# Altium schematic sheet MODEM_PT1.SchDoc: MODEM PERIPHERALS
size 420 x 297 mm; SheetNumber: 7; SheetTotal: 8
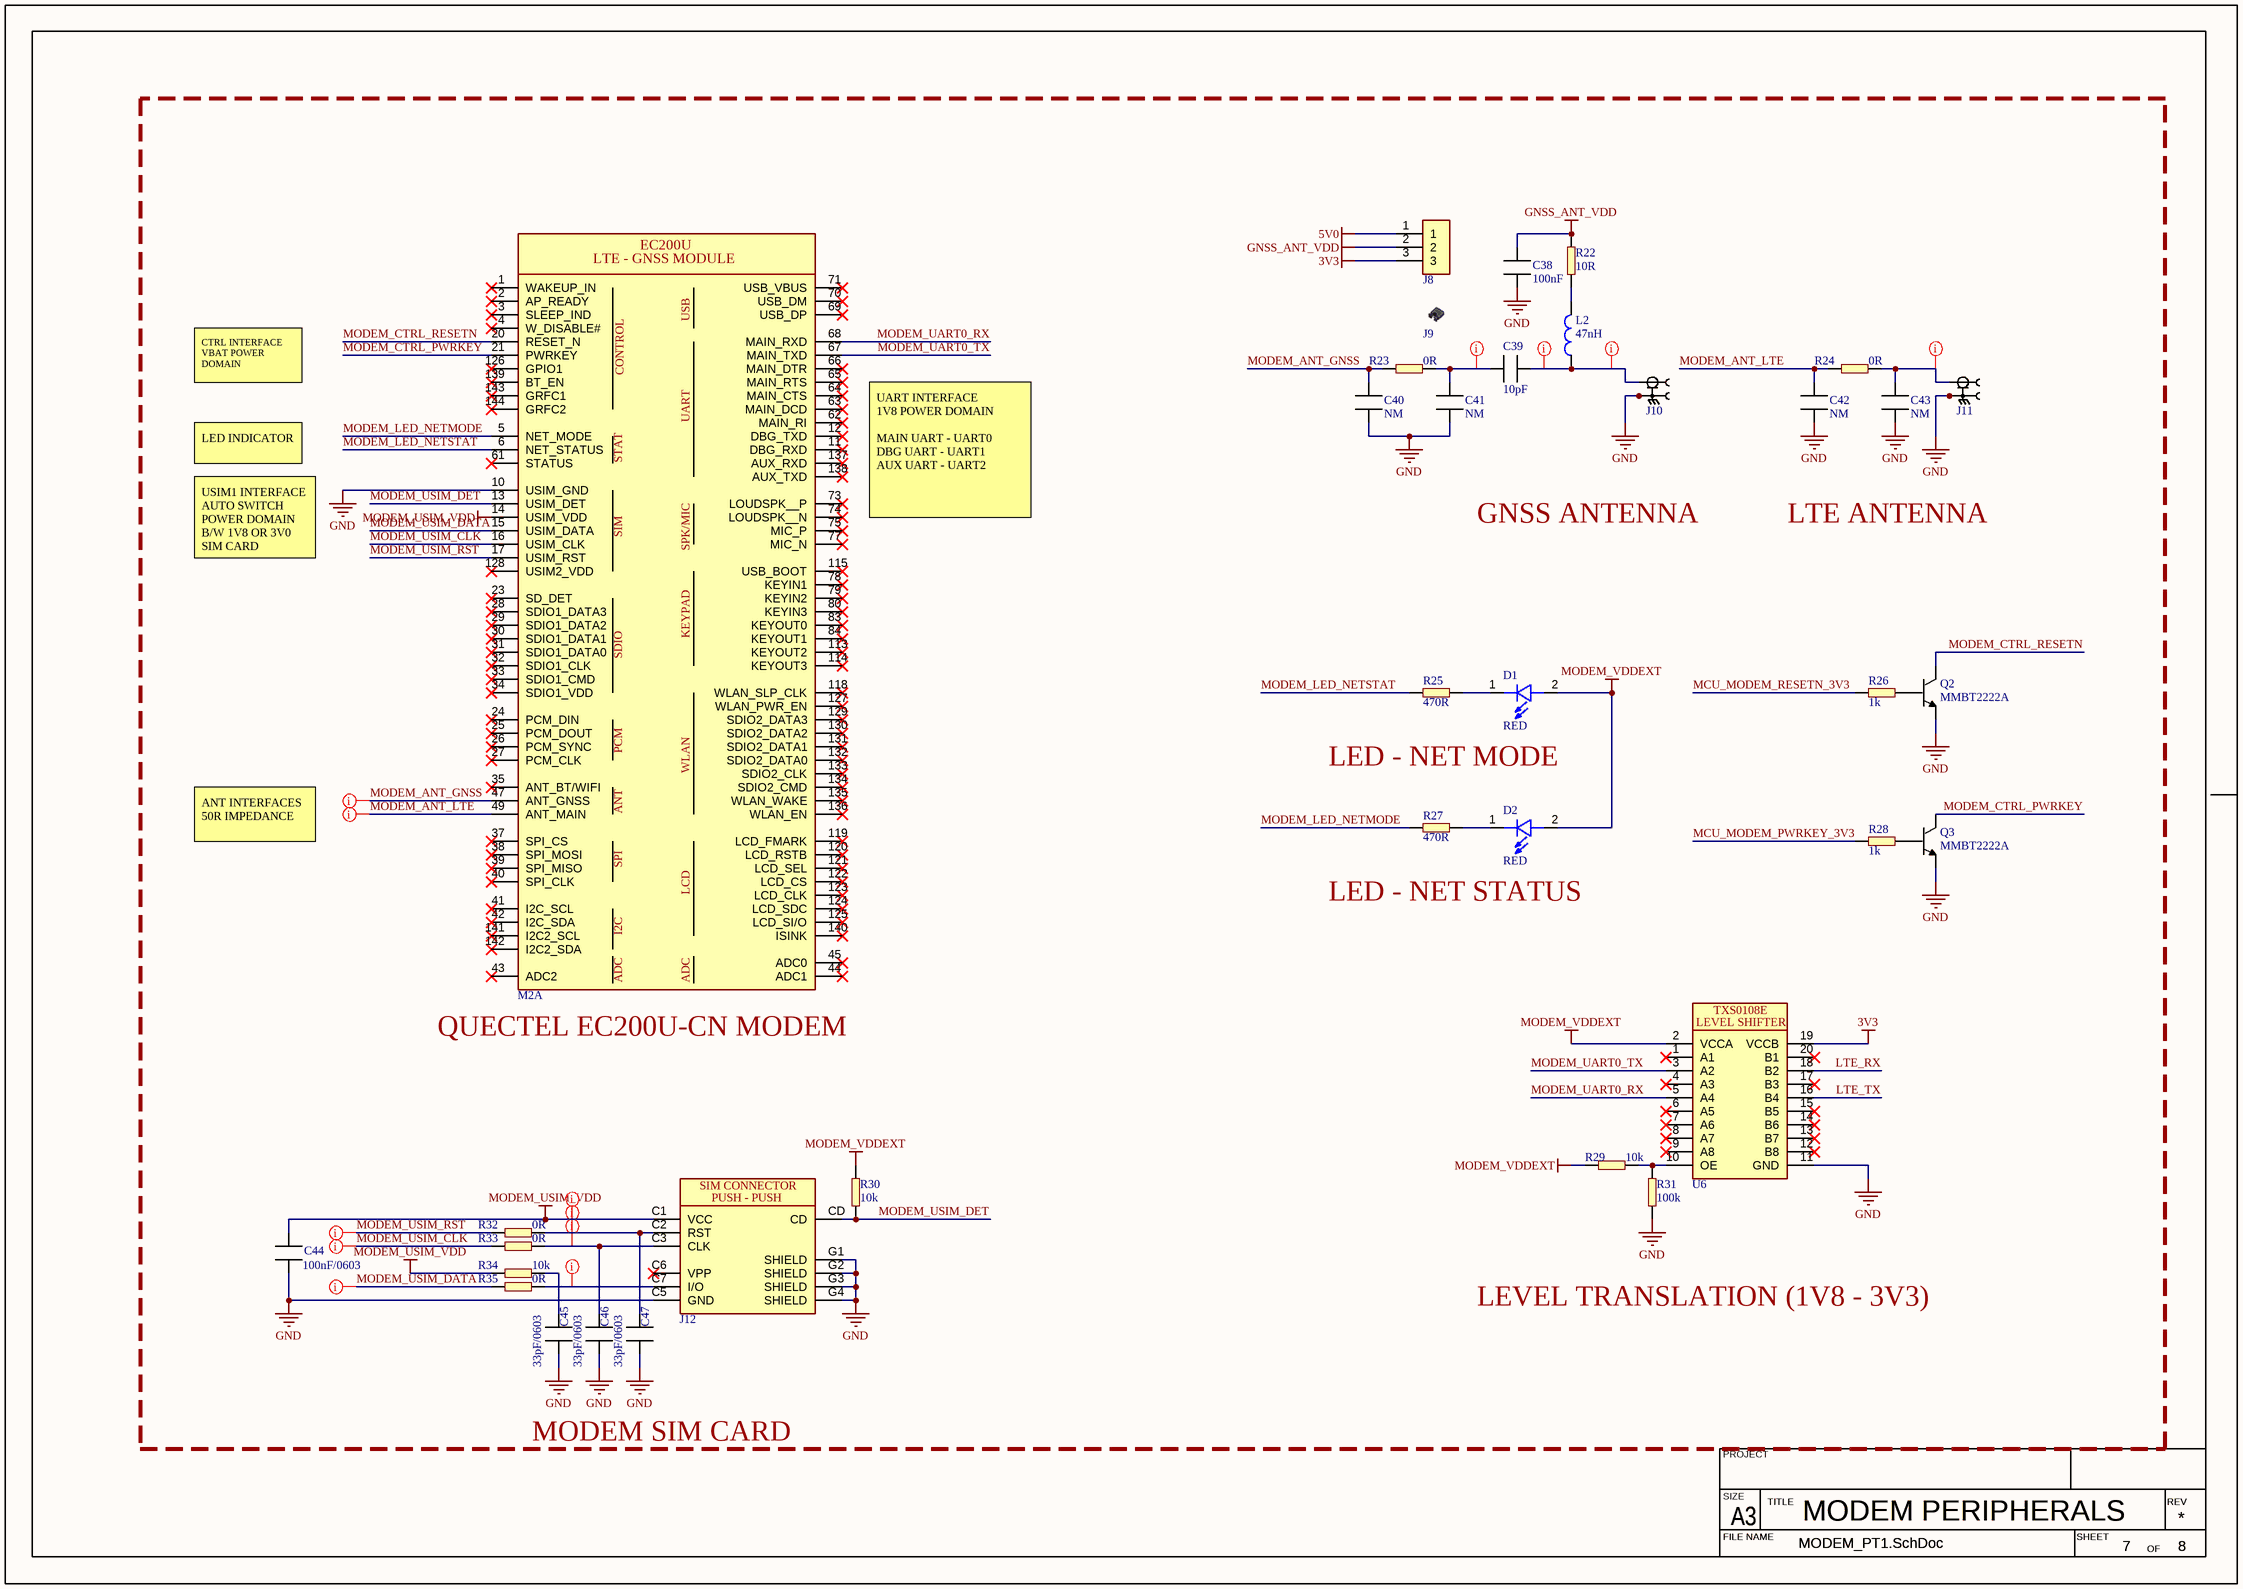
[diagram p0: MODEM_PT1.SchDoc]

## Parts
C38  value 100nF  [CAPC2012X13L]  (hidden comment: MLCC_0805)  (no BOM)
C39  value 10pF  [CAPC0603X03L]  (hidden comment: ERP_102-1)
C40  value NM  [CAPC0603X03L]  (hidden comment: ERP_102-1)  (no BOM)
C41  value NM  [CAPC0603X03L]  (hidden comment: ERP_102-1)  (no BOM)
C42  value NM  [CAPC0603X03L]  (hidden comment: ERP_102-1)  (no BOM)
C43  value NM  [CAPC0603X03L]  (hidden comment: ERP_102-1)  (no BOM)
C44  value 100nF/0603  [CAPC1608X10N]  (hidden comment: ERP_102-1)
C45  value 33pF/0603  [CAPC1608X10N]  (hidden comment: ERP_102-1)
C46  value 33pF/0603  [CAPC1608X10N]  (hidden comment: ERP_102-1)
C47  value 33pF/0603  [CAPC1608X10N]  (hidden comment: ERP_102-1)
D1  value RED  [LED_1206]  (hidden comment: LED_1206)
D2  value RED  [LED_1206]  (hidden comment: LED_1206)
J8  3PX1R_M  [3PX1R_THT]  (value not drawn)
J9  Jumper Cap  [Jumper Cap]  (value not drawn)
J10  ERP_148-1  [uFL_50R]  (value not drawn)
J11  ERP_148-1  [uFL_50R]  (value not drawn)
J12  MUP-7801-1  [MUP-7801-1]  (value not drawn)
L2  value 47nH  [IND_0603]  (hidden comment: ERP_103-3)
M2  EC200U  [EC200U]  (value not drawn)  (part A of 2)
Q2  value MMBT2222A  [MMBT2222]  (hidden comment: ERP_105-1)
Q3  value MMBT2222A  [MMBT2222]  (hidden comment: ERP_105-1)
R22  value 10R  [RES_0603]  (hidden comment: ERP_101-1)
R23  value 0R  [RESC0603X03L]  (hidden comment: ERP_101-1)
R24  value 0R  [RESC0603X03L]  (hidden comment: ERP_101-1)
R25  value 470R  [RES_0603]  (hidden comment: ERP_101-1)
R26  value 1k  [RES_0603]  (hidden comment: ERP_101-1)
R27  value 470R  [RES_0603]  (hidden comment: ERP_101-1)
R28  value 1k  [RES_0603]  (hidden comment: ERP_101-1)
R29  value 10k  [RES_0603]  (hidden comment: ERP_101-1)
R30  value 10k  [RES_0603]  (hidden comment: ERP_101-1)
R31  value 100k  [RES_0603]  (hidden comment: ERP_101-1)
R32  value 0R  [RES_0603]  (hidden comment: ERP_101-1)
R33  value 0R  [RES_0603]  (hidden comment: ERP_101-1)
R34  value 10k  [RES_0603]  (hidden comment: ERP_101-1)
R35  value 0R  [RES_0603]  (hidden comment: ERP_101-1)
U6  TXS0108EPW  [TXS0108EPW]  (value not drawn)

## Nets
3V3: J8.3 U6.19(VCCB)
5V0: J8.1
GND: C38.2 C40.1 C41.1 C42.1 C43.1 C44.2 C45.2 C46.2 C47.2 J10.1 J10.2 J11.1 J11.2 J12.C5(GND) J12.G1(SHIELD) J12.G2(SHIELD) J12.G3(SHIELD) J12.G4(SHIELD) M2.10(USIM_GND) Q2.2 Q3.2 R31.2 U6.11(GND)
GNSS_ANT_VDD: C38.1 J8.2 R22.2
MODEM_USIM_VDD: C44.1 J12.C1(VCC) M2.14(USIM_VDD) R34.2
MODEM_VDDEXT: D1.2 D2.2 R29.2 R30.2 U6.2(VCCA)
LTE_RX: U6.18(B2)
LTE_TX: U6.16(B4)
MCU_MODEM_PWRKEY_3V3: R28.2
MCU_MODEM_RESETN_3V3: R26.2
MODEM_ANT_GNSS: C40.2 M2.47(ANT_GNSS) R23.2
MODEM_ANT_LTE: C42.2 M2.49(ANT_MAIN) R24.2
MODEM_CTRL_PWRKEY: M2.21(PWRKEY) Q3.3
MODEM_CTRL_RESETN: M2.20(RESET_N) Q2.3
MODEM_LED_NETMODE: M2.5(NET_MODE) R27.2
MODEM_LED_NETSTAT: M2.6(NET_STATUS) R25.2
MODEM_UART0_RX: M2.68(MAIN_RXD) U6.5(A4)
MODEM_UART0_TX: M2.67(MAIN_TXD) U6.3(A2)
MODEM_USIM_CLK: M2.16(USIM_CLK) R33.2
MODEM_USIM_DATA: M2.15(USIM_DATA) R35.2
MODEM_USIM_DET: J12.CD M2.13(USIM_DET) R30.1
MODEM_USIM_RST: M2.17(USIM_RST) R32.2
NetC39_1: C39.1 J10.3 L2.1
NetC39_2: C39.2 C41.2 R23.1
NetC43_2: C43.2 J11.3 R24.1
NetC45_1: C45.1 R34.1
NetC46_1: C46.1 J12.C3(CLK) R33.1
NetC47_1: C47.1 J12.C2(RST) R32.1
NetD1_1: D1.1 R25.1
NetD2_1: D2.1 R27.1
NetJ12_C7: J12.C7(I/O) R35.1
NetL2_2: L2.2 R22.1
NetQ2_1: Q2.1 R26.1
NetQ3_1: Q3.1 R28.1
NetR29_1: R29.1 R31.1 U6.10(OE)

Not connected (* = marked no-connect by the designer): J12 C6(VPP)*; M2 1(WAKEUP_IN)* 2(AP_READY)* 3(SLEEP_IND)* 4(W_DISABLE#)* 11(DBG_RXD)* 12(DBG_TXD)* 23(SD_DET)* 24(PCM_DIN)* 25(PCM_DOUT)* 26(PCM_SYNC)* 27(PCM_CLK)* 28(SDIO1_DATA3)* 29(SDIO1_DATA2)* 30(SDIO1_DATA1)* 31(SDIO1_DATA0)* 32(SDIO1_CLK)* 33(SDIO1_CMD)* 34(SDIO1_VDD)* 35(ANT_BT/WIFI)* 37(SPI_CS)* 38(SPI_MOSI)* 39(SPI_MISO)* 40(SPI_CLK)* 41(I2C_SCL)* 42(I2C_SDA)* 43(ADC2)* 44(ADC1)* 45(ADC0)* 61(STATUS)* 62(MAIN_RI)* 63(MAIN_DCD)* 64(MAIN_CTS)* 65(MAIN_RTS)* 66(MAIN_DTR)* 69(USB_DP)* 70(USB_DM)* 71(USB_VBUS)* 73(LOUDSPK__P)* 74(LOUDSPK__N)* 75(MIC_P)* 77(MIC_N)* 78(KEYIN1)* 79(KEYIN2)* 80(KEYIN3)* 83(KEYOUT0)* 84(KEYOUT1)* 113(KEYOUT2)* 114(KEYOUT3)* 115(USB_BOOT)* 118(WLAN_SLP_CLK)* 119(LCD_FMARK)* 120(LCD_RSTB)* 121(LCD_SEL)* 122(LCD_CS)* 123(LCD_CLK)* 124(LCD_SDC)* 125(LCD_SI/O)* 126(GPIO1)* 127(WLAN_PWR_EN)* 128(USIM2_VDD)* 129(SDIO2_DATA3)* 130(SDIO2_DATA2)* 131(SDIO2_DATA1)* 132(SDIO2_DATA0)* 133(SDIO2_CLK)* 134(SDIO2_CMD)* 135(WLAN_WAKE)* 136(WLAN_EN)* 137(AUX_RXD)* 138(AUX_TXD)* 139(BT_EN)* 140(ISINK)* 141(I2C2_SCL)* 142(I2C2_SDA)* 143(GRFC1)* 144(GRFC2)*; U6 1(A1)* 4(A3)* 6(A5)* 7(A6)* 8(A7)* 9(A8)* 12(B8)* 13(B7)* 14(B6)* 15(B5)* 17(B3)* 20(B1)*

## Layout directives
net class ANT_50R; rule Width Constraint [Pref Impedance = 50.00ohms    Min Impedance = 50.00ohms    Max Impedance = 50.00ohms]: MODEM_ANT_GNSS, MODEM_ANT_LTE, NetC39_1, NetC39_2, NetC43_2
rule Width Constraint [Pref Impedance = 50.00ohms    Min Impedance = 50.00ohms    Max Impedance = 50.00ohms]: MODEM_USIM_CLK, MODEM_USIM_DATA, MODEM_USIM_RST, NetC46_1, NetJ12_C7
rule Width Constraint [Pref Width = 0.366mm    Min Width = 0.183mm    Max Width = 0.366mm]: NetC47_1
rule Width Constraint [Pref Width = 0.5mm    Min Width = 0.335mm    Max Width = 1mm]: MODEM_USIM_VDD

## Notes on the sheet
- CTRL INTERFACE
  VBAT POWER DOMAIN
- LED INDICATOR
- UART INTERFACE
  1V8 POWER DOMAIN
  MAIN UART - UART0
  DBG UART - UART1
  AUX UART - UART2
- GNSS ANTENNA
- LTE ANTENNA
- USIM1 INTERFACE
  AUTO SWITCH POWER DOMAIN B/W 1V8 OR 3V0 SIM CARD
- LED - NET MODE
- ANT INTERFACES
  50R IMPEDANCE
- LED - NET STATUS
- (near M2) QUECTEL EC200U-CN MODEM
- LEVEL TRANSLATION (1V8 - 3V3)
- MODEM SIM CARD
- PROJECT
- SIZE
- FILE NAME
- A3
- TITLE
- SHEET
- OF
- REV
- (in symbol EC200U, part A) LTE - GNSS MODULE; USB; CONTROL; UART; STAT; SIM; SPK/MIC; KEYPAD; SDIO; PCM; WLAN; ANT; SPI; LCD; I2C; ADC
- (in symbol MUP-7801-1) SIM CONNECTOR; PUSH - PUSH
- (in symbol TXS0108EPW) TXS0108E; LEVEL SHIFTER

## Library data of the parts
C38 = MLCC_0805: Chip Capacitor, 2-Leads, Body 2.00x1.25mm, IPC High Density; Package: 0805; Manufacturer 1: *; Manufacturer Part Number 1: *
C39-C43 = MLCC_0201: Chip Capacitor, 2-Leads, Body 0.60x0.30mm, IPC High Density; Package: 0201; Manufacturer 1: *; Manufacturer Part Number 1: *
C44-C47 = MLCC_0603: Chip Capacitor, 2-Leads, Body 1.60x0.80mm, IPC Medium Density; Package: 0603; Manufacturer 1: *; Manufacturer Part Number 1: *
D1 D2 = LED_1206: LED CLEAR 1206 SMD; Manufacturer Part Number 1: 6395; Manufacturer 1: Sunrom
J8 = 3PX1R_M: 3PX1R Male Header; Value: C49257; Manufacturer 1: *; Manufacturer Part Number 1: *
J9 = Jumper Cap: 2 Pin Jumper Cap P2.54; Manufacturer Part Number 1: *; Manufacturer 1: *; Value: *
J10 J11 = uFL_50R: Package: L3W3; Value: *; ERP: *; Manufacturer 1: *; Manufacturer Part Number 1: *; Supplier 1: *; Suuplier Part Number 1: *
J12 = MUP-7801-1: 7 (6 + 1) Position Card Connector NANO SIM Surface Mount, Right Angle Gold; Manufacturer Part Number 1: MUP-C7801-02; Manufacturer 1: MUP; Package: 7 (6 + 1); Value: *; Supplier Part Number 1: ST2103SD1921
L2 = IND_0603: ERP: *; Suuplier Part Number 1: *; Supplier 1: *; Manufacturer Part Number 1: *; Manufacturer 1: *; Package: 0603
M2 = EC200U: LTE CAT1 MODEM 144 SMD; Manufacturer 1: Quectel; Manufacturer Part Number 1: 027-EC200UCNAA-N05-SGNSA; Value: *
Q2 Q3 = MMBT2222: MMBT2222A; ERP: *; Suuplier Part Number 1: *; Supplier 1: *; Manufacturer Part Number 1: *; Manufacturer 1: *; Package: SOT23
R22 R25-R35 = RES_0603: Package: 0603; Manufacturer 1: *; Manufacturer Part Number 1: *
  R25-R28: ERP: *
R23 R24 = RES_0201: Package: 0201; Manufacturer 1: *; Manufacturer Part Number 1: *
U6 = TXS0108EPW: Voltage Level Translator Bidirectional 1 Circuit 8 Channel 60Mbps 20-TSSOP; Manufacturer Part Number 1: TXS0108EPWR; Manufacturer 1: Texas Instruments; Package: 20-TSSOP; Value: *